# EAGLE design esplash (EAGLE 9.6.2)
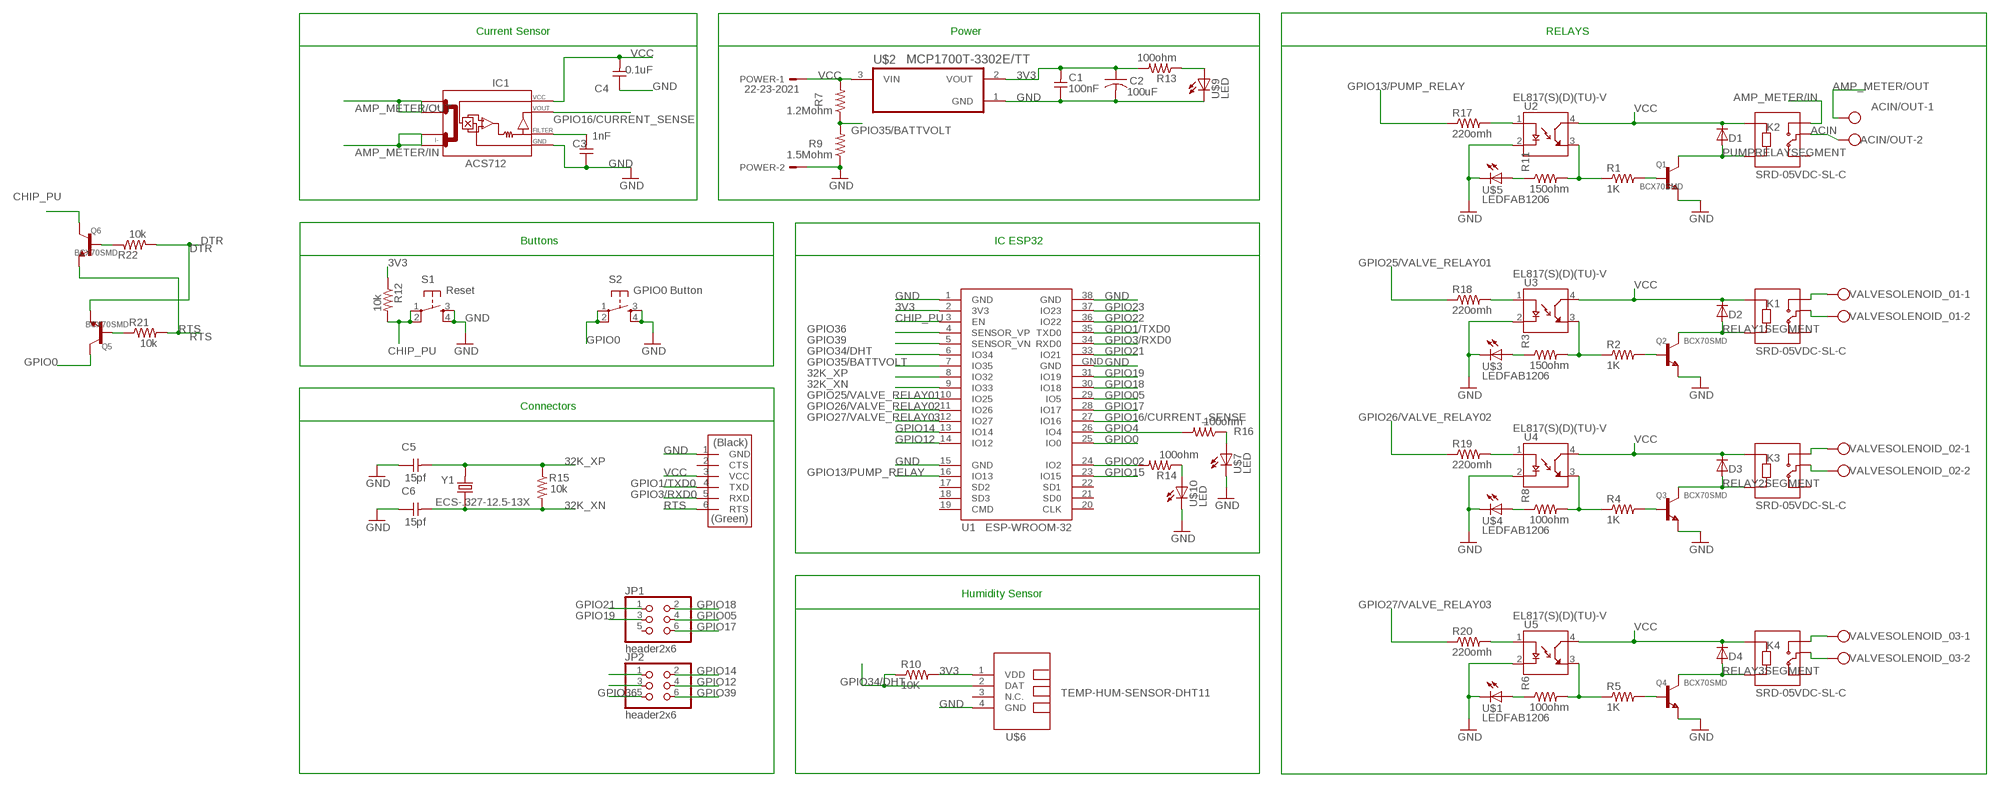
[diagram p0: schematic, sheet 1]

## Parts
ACIN/OUT  W237-102  [W237-102]
C1  100nF  CAP-UNPOLARIZEDFAB  [C1206FAB]
C2  100uF  CAP-US1206FAB  [C1206FAB]
C3  1nF  CAP-UNPOLARIZEDFAB  [C1206FAB]
C4  0.1uF  CAP-UNPOLARIZEDFAB  [C1206FAB]
C5  15pf  CAP-UNPOLARIZEDFAB  [C1206FAB]
C6  15pf  CAP-UNPOLARIZEDFAB  [C1206FAB]
D1  DIODESOD123  [SOD123]
D2  DIODESOD123  [SOD123]
D3  DIODESOD123  [SOD123]
D4  DIODESOD123  [SOD123]
IC1  ACS712  [SO08]
JP1  header2x6  PINHD-2X3  [2X03]
JP2  header2x6  PINHD-2X3  [2X03]
K1  SRD-05VDC-SL-C  [RELAY_SRD-05VDC-SL-C]
K2  SRD-05VDC-SL-C  [RELAY_SRD-05VDC-SL-C]
K3  SRD-05VDC-SL-C  [RELAY_SRD-05VDC-SL-C]
K4  SRD-05VDC-SL-C  [RELAY_SRD-05VDC-SL-C]
POWER  22-23-2021  [22-23-2021]
Q1  BCX70SMD  [SOT23]
Q2  BCX70SMD  [SOT23]
Q3  BCX70SMD  [SOT23]
Q4  BCX70SMD  [SOT23]
Q5  BCX70SMD  [SOT23]
Q6  BCX70SMD  [SOT23]
R1  1K  RES-US1206FAB  [R1206FAB]
R2  1K  RES-US1206FAB  [R1206FAB]
R3  150ohm  RES-US1206FAB  [R1206FAB]
R4  1K  RES-US1206FAB  [R1206FAB]
R5  1K  RES-US1206FAB  [R1206FAB]
R6  100ohm  RES-US1206FAB  [R1206FAB]
R7  1.2Mohm  RES-US1206FAB  [R1206FAB]
R8  100ohm  RES-US1206FAB  [R1206FAB]
R9  1.5Mohm  RES-US1206FAB  [R1206FAB]
R10  10K  RES-US1206FAB  [R1206FAB]
R11  150ohm  RES-US1206FAB  [R1206FAB]
R12  10k  RES-US1206  [R1206]
R13  100ohm  RES-US1206  [R1206]
R14  100ohm  RES-US1206  [R1206]
R15  10k  RES-US1206  [R1206]
R16  100ohm  RES-US1206  [R1206]
R17  220omh  RES-US1206FAB  [R1206FAB]
R18  220omh  RES-US1206FAB  [R1206FAB]
R19  220omh  RES-US1206FAB  [R1206FAB]
R20  220omh  RES-US1206FAB  [R1206FAB]
R21  10k  RES-US1206  [R1206]
R22  10k  RES-US1206  [R1206]
RTS  FTDI-SMD-HEADER  [1X06SMD]
S1  Reset  6MM_SWITCH6MM_SWITCH  [6MM_SWITCH]
S2  GPIO0 Button  6MM_SWITCH6MM_SWITCH  [6MM_SWITCH]
U1  ESP-WROOM-32  [ESP-WROOM-32]
U2  EL817(S)(D)(TU)-V  [SOIC254P1030X460-4N]
U3  EL817(S)(D)(TU)-V  [SOIC254P1030X460-4N]
U4  EL817(S)(D)(TU)-V  [SOIC254P1030X460-4N]
U5  EL817(S)(D)(TU)-V  [SOIC254P1030X460-4N]
U$1  LEDFAB1206  [LED1206FAB]
U$2  MCP1700T-3302E/TT  [SOT95P237X112-3N]
U$3  LEDFAB1206  [LED1206FAB]
U$4  LEDFAB1206  [LED1206FAB]
U$5  LEDFAB1206  [LED1206FAB]
U$6  TEMP-HUM-SENSOR-DHT11  [TEMP-HUM-SENSOR-DHT11]
U$7  LED  [LED1206]
U$9  LED  [LED1206]
U$10  LED  [LED1206]
VALVESOLENOID_01  W237-102  [W237-102]
VALVESOLENOID_02  W237-102  [W237-102]
VALVESOLENOID_03  W237-102  [W237-102]
Y1  ECS-.327-12.5-13X  [XTAL_ECS-.327-12.5-13X]

## Nets
3V3: C1.2 C2.1 R10.2 R12.1 R13.2 U1.2(3V3) U$2.2(VOUT) U$6.1(VDD)
32K_XN: C6.2 R15.2 U1.9(IO33) Y1.1
32K_XP: C5.2 R15.1 U1.8(IO32) Y1.2
ACIN: ACIN/OUT.2 K2.COM
AMP_METER/IN: IC1.3(I-_0) IC1.4(I-_1) K2.NO
AMP_METER/OUT: ACIN/OUT.1 IC1.1(I+_0) IC1.2(I+_1)
CHIP_PU: Q6.3(C) R12.2 S1.1(P) S1.2(P1) U1.3(EN)
DELETE: C3.2 IC1.6(FILTER)
DTR: Q5.2(E) R22.2
GND: C1.1 C2.2 C3.1 C4.1 C5.1 C6.1 IC1.5(GND) POWER.2 Q1.2(E) Q2.2(E) Q3.2(E) Q4.2(E) R9.1 RTS.1(GND) S1.3(S) S1.4(S1) S2.3(S) S2.4(S1) U1.1(GND) U1.15(GND) U1.38(GND) U1.GND U2.2(C) U3.2(C) U4.2(C) U5.2(C) U$1.2(C) U$2.1(GND) U$3.2(C) U$4.2(C) U$5.2(C) U$6.4(GND) U$7.2(C) U$9.2(C) U$10.2(C)
GPIO0: Q5.3(C) S2.1(P) S2.2(P1) U1.25(IO0)
GPIO1/TXD0: RTS.4(TXD) U1.35(TXD0)
GPIO02: R14.2 U1.24(IO2)
GPIO3/RXD0: RTS.5(RXD) U1.34(RXD0)
GPIO4: R16.2 U1.26(IO4)
GPIO05: JP1.4 U1.29(IO5)
GPIO12: JP2.4 U1.14(IO12)
GPIO13/PUMP_RELAY: R17.1 U1.16(IO13)
GPIO14: JP2.2 U1.13(IO14)
GPIO15: U1.23(IO15)
GPIO16/CURRENT_SENSE: IC1.7(VOUT) U1.27(IO16)
GPIO17: JP1.6 U1.28(IO17)
GPIO18: JP1.2 U1.30(IO18)
GPIO19: JP1.3 U1.31(IO19)
GPIO21: JP1.1 U1.33(IO21)
GPIO22: U1.36(IO22)
GPIO23: U1.37(IO23)
GPIO25/VALVE_RELAY01: R18.1 U1.10(IO25)
GPIO26/VALVE_RELAY02: R19.1 U1.11(IO26)
GPIO27/VALVE_RELAY03: R20.1 U1.12(IO27)
GPIO34/DHT: R10.1 U1.6(IO34) U$6.2(DAT)
GPIO35/BATTVOLT: R7.1 R9.2 U1.7(IO35)
GPIO36: JP2.5 U1.4(SENSOR_VP)
GPIO39: JP2.6 U1.5(SENSOR_VN)
N$2: R1.1 R11.2 U2.3(ET)
N$5: K1.COM VALVESOLENOID_01.2
N$7: Q2.1(B) R2.2
N$8: R11.1 U$5.1(A)
N$10: R14.1 U$10.1(A)
N$12: K1.NO VALVESOLENOID_01.1
N$13: R3.1 U$3.1(A)
N$14: R2.1 R3.2 U3.3(ET)
N$15: K3.COM VALVESOLENOID_02.2
N$16: Q3.1(B) R4.2
N$17: R8.1 U$4.1(A)
N$18: R4.1 R8.2 U4.3(ET)
N$19: K3.NO VALVESOLENOID_02.1
N$20: K4.COM VALVESOLENOID_03.2
N$21: Q4.1(B) R5.2
N$22: R6.1 U$1.1(A)
N$23: R5.1 R6.2 U5.3(ET)
N$24: K4.NO VALVESOLENOID_03.1
N$25: R13.1 U$9.1(A)
N$26: Q5.1(B) R21.1
N$27: JP2.1
N$28: JP2.3
N$29: R16.1 U$7.1(A)
N$30: R17.2 U2.1(A)
N$31: R18.2 U3.1(A)
N$32: R19.2 U4.1(A)
N$33: R20.2 U5.1(A)
N$34: Q6.1(B) R22.1
N$43: Q1.1(B) R1.2
PUMPRELAYSEGMENT: D1.ANODE(A) K2.A2 Q1.3(C)
RELAY1SEGMENT: D2.ANODE(A) K1.A2 Q2.3(C)
RELAY2SEGMENT: D3.ANODE(A) K3.A2 Q3.3(C)
RELAY3SEGMENT: D4.ANODE(A) K4.A2 Q4.3(C)
RTS: Q6.2(E) R21.2 RTS.6(RTS)
VCC: C4.2 D1.CATHODE(C) D2.CATHODE(C) D3.CATHODE(C) D4.CATHODE(C) IC1.8(VCC) K1.A1 K2.A1 K3.A1 K4.A1 POWER.1 R7.2 RTS.3(VCC) U2.4(CT) U3.4(CT) U4.4(CT) U5.4(CT) U$2.3(VIN)
Unconnected: JP1.5 K1.NC K2.NC K3.NC K4.NC RTS.2(CTS) U1.17(SD2) U1.18(SD3) U1.19(CMD) U1.20(CLK) U1.21(SD0) U1.22(SD1) U$6.3(N.C.)

## Notes on the sheet
- Current Sensor | Power | RELAYS
- Buttons | IC ESP32
- Connectors
- Humidity Sensor

## Library data of the parts
ACIN/OUT VALVESOLENOID_01-VALVESOLENOID_03 = con-wago-500:W237-102: WAGO SCREW CLAMP; MPN: 237-102; OC_FARNELL: unknown; OC_NEWARK: 70K9898
C1 C3-C6 = fab:CAP-UNPOLARIZED
C2 = fab:CAP-US
D1-D4 = fab:DIODE: DIODE high speed (Philips)
IC1 = ACS712:ACS712
JP1 JP2 = pinhead:PINHD-2X3: PIN HEADER
K1-K4 = SRD-05VDC-SL-C:SRD-05VDC-SL-C: 5V Trigger Relay Module For Arduino And Raspberry Pi 5V Trigger Relay Module For Arduino And Raspberry Pi; AVAILABILITY: Unavailable; DESCRIPTION: 5V Trigger Relay Module For Arduino And Raspberry Pi 5V Trigger Relay Module For Arduino And Raspberry Pi; MF: Songle Relay; MP: SRD-05VDC-SL-C; PACKAGE: None; PRICE: None
POWER = con-molex:22-23-2021: .100" (2.54mm) Center Header - 2 Pin; MF: MOLEX; MPN: 22-23-2021; OC_FARNELL: 1462926; OC_NEWARK: 25C3832
Q1-Q6 = transistor:BCX70SMD: NPN TRANSISTOR
R1-R22 = fab:RES-US: Resistor (US Symbol) Variants with postfix FAB are widened to allow the routing of internal traces
RTS = fab:FTDI-SMD-HEADER
S1 S2 = fab:6MM_SWITCH: OMRON SWITCH
U1 = esp32:ESP-WROOM-32: Espressif Systems ESP-WROOM-32
U2-U5 = EL817_S__D__TU_-V:EL817(S)(D)(TU)-V: Optocoupler DC-IN 1-CH Transistor DC-OUT 4-Pin PDIP Tube; AVAILABILITY: Unavailable; DESCRIPTION: Optoisolator Transistor Output 5000Vrms 1 Channel 4-SMD; MF: Everlight Electronics; MP: EL817(S)(D)(TU)-V; PACKAGE: SMD-4 Everlight; PRICE: None
U$1 U$3-U$5 U$7 U$9 U$10 = fab:LED: LED
U$2 = MCP1700T-3302E_TT:MCP1700T-3302E/TT; ARROW_AMERICAS-PURCHASE-URL: https://snapeda.com/shop?store=Arrow+Americas&id=4791194; AVAILABILITY: Unavailable; DESCRIPTION: IC REG LINEAR 3.3V 250MA SOT23-3; DIGIKEY-PURCHASE-URL: https://snapeda.com/shop?store=DigiKey&id=4791194; MF: Microchip Technology; MOUSER-PURCHASE-URL: https://snapeda.com/shop?store=Mouser&id=4791194; MP: MCP1700T-3302E/TT; PACKAGE: None; PRICE: None
U$6 = diy-modules:TEMP-HUM-SENSOR-DHT11: DHT11 - digital humidity & temperature sensor DHT11 datasheet available here: https://akizukidenshi.com/download/ds/aosong/DHT11.pdf Click here to find device on ebay.com <http://www.ebay.com/sch/dht11+digital+sensor>
Y1 = ECS-.327-12.5-13X:ECS-.327-12.5-13X: Crystal Cylindrical Can, Radial; AVAILABILITY: Unavailable; DESCRIPTION: 32.768kHz ±20ppm Crystal 12.5pF 35 kOhms Cylindrical Can, Radial; MF: ECS Inc.; MP: ECS-.327-12.5-13X; PACKAGE: Cylindrical Can Radial ECS International; PRICE: None

## Board
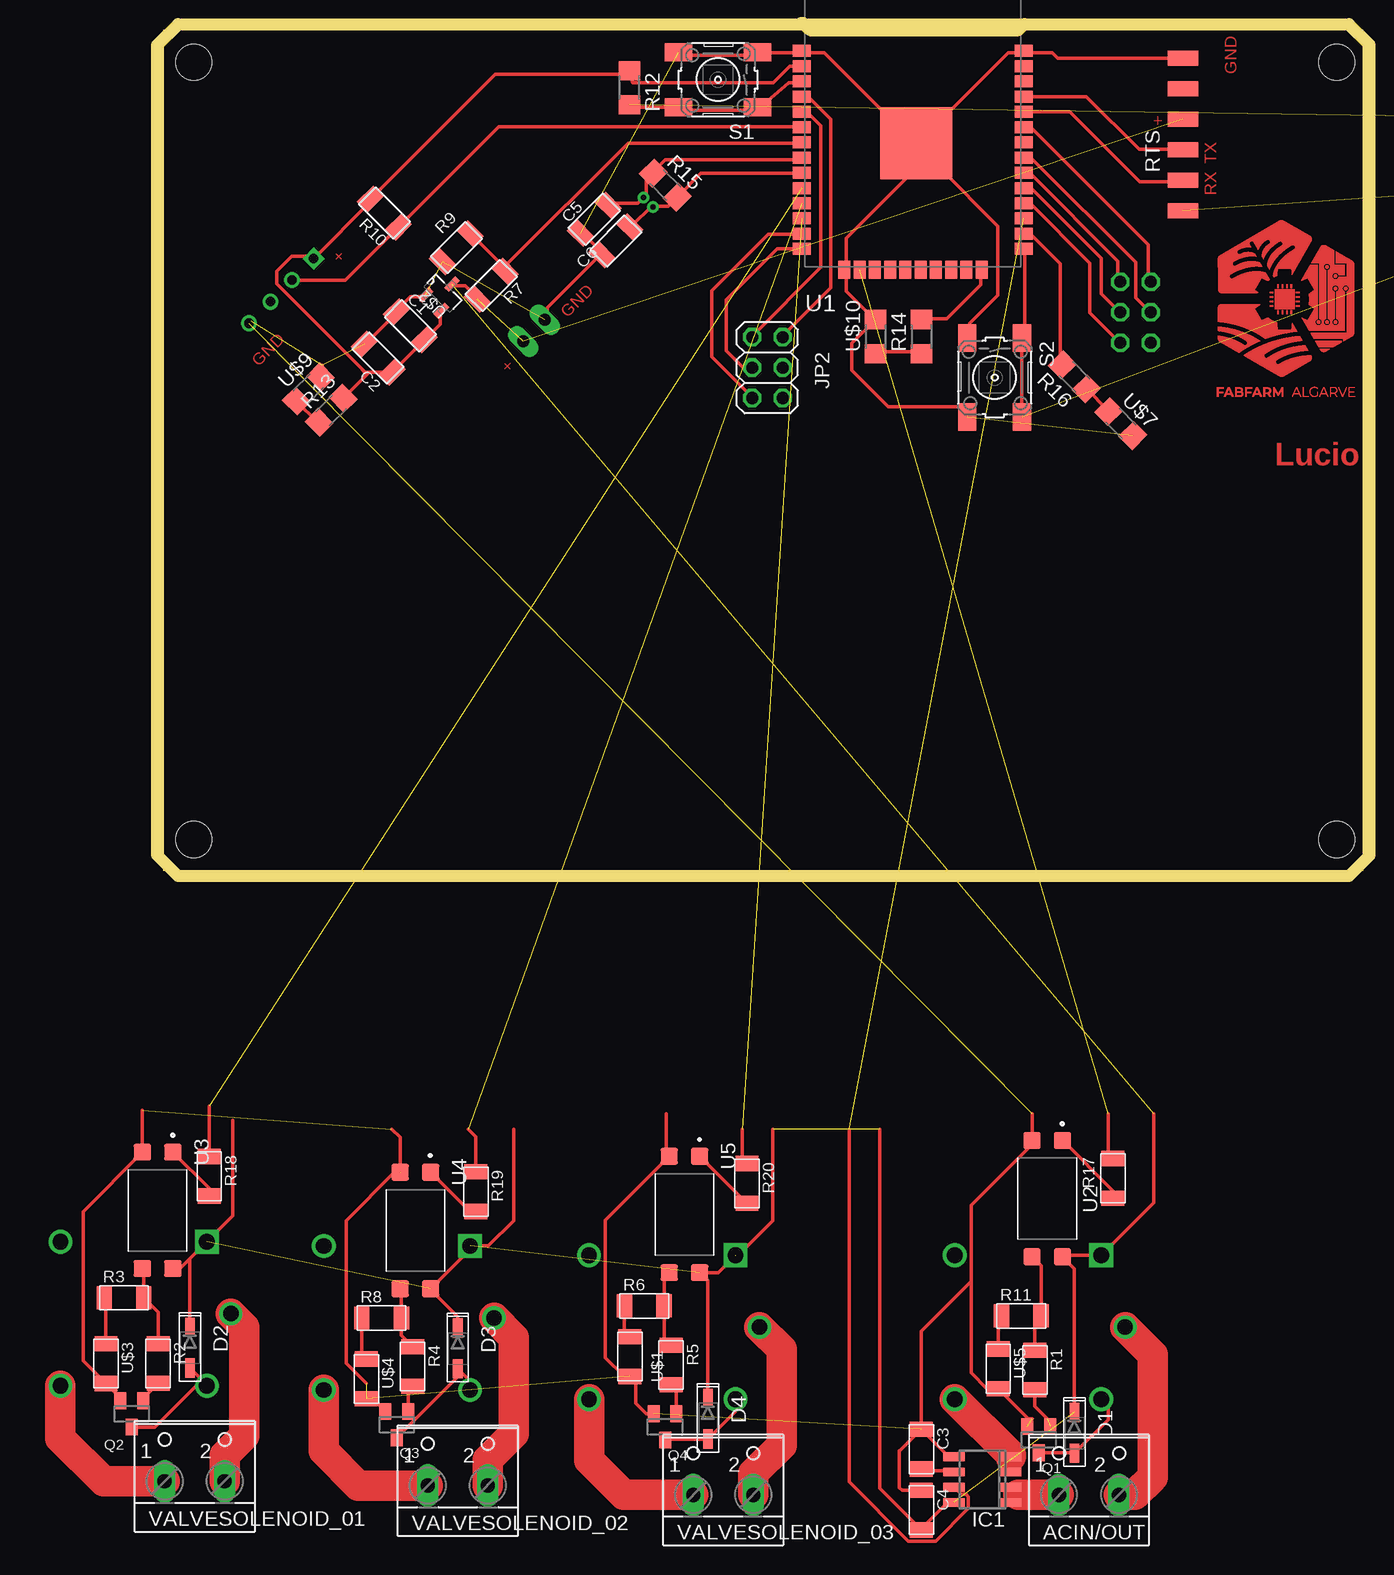
[diagram p1: board, top side]
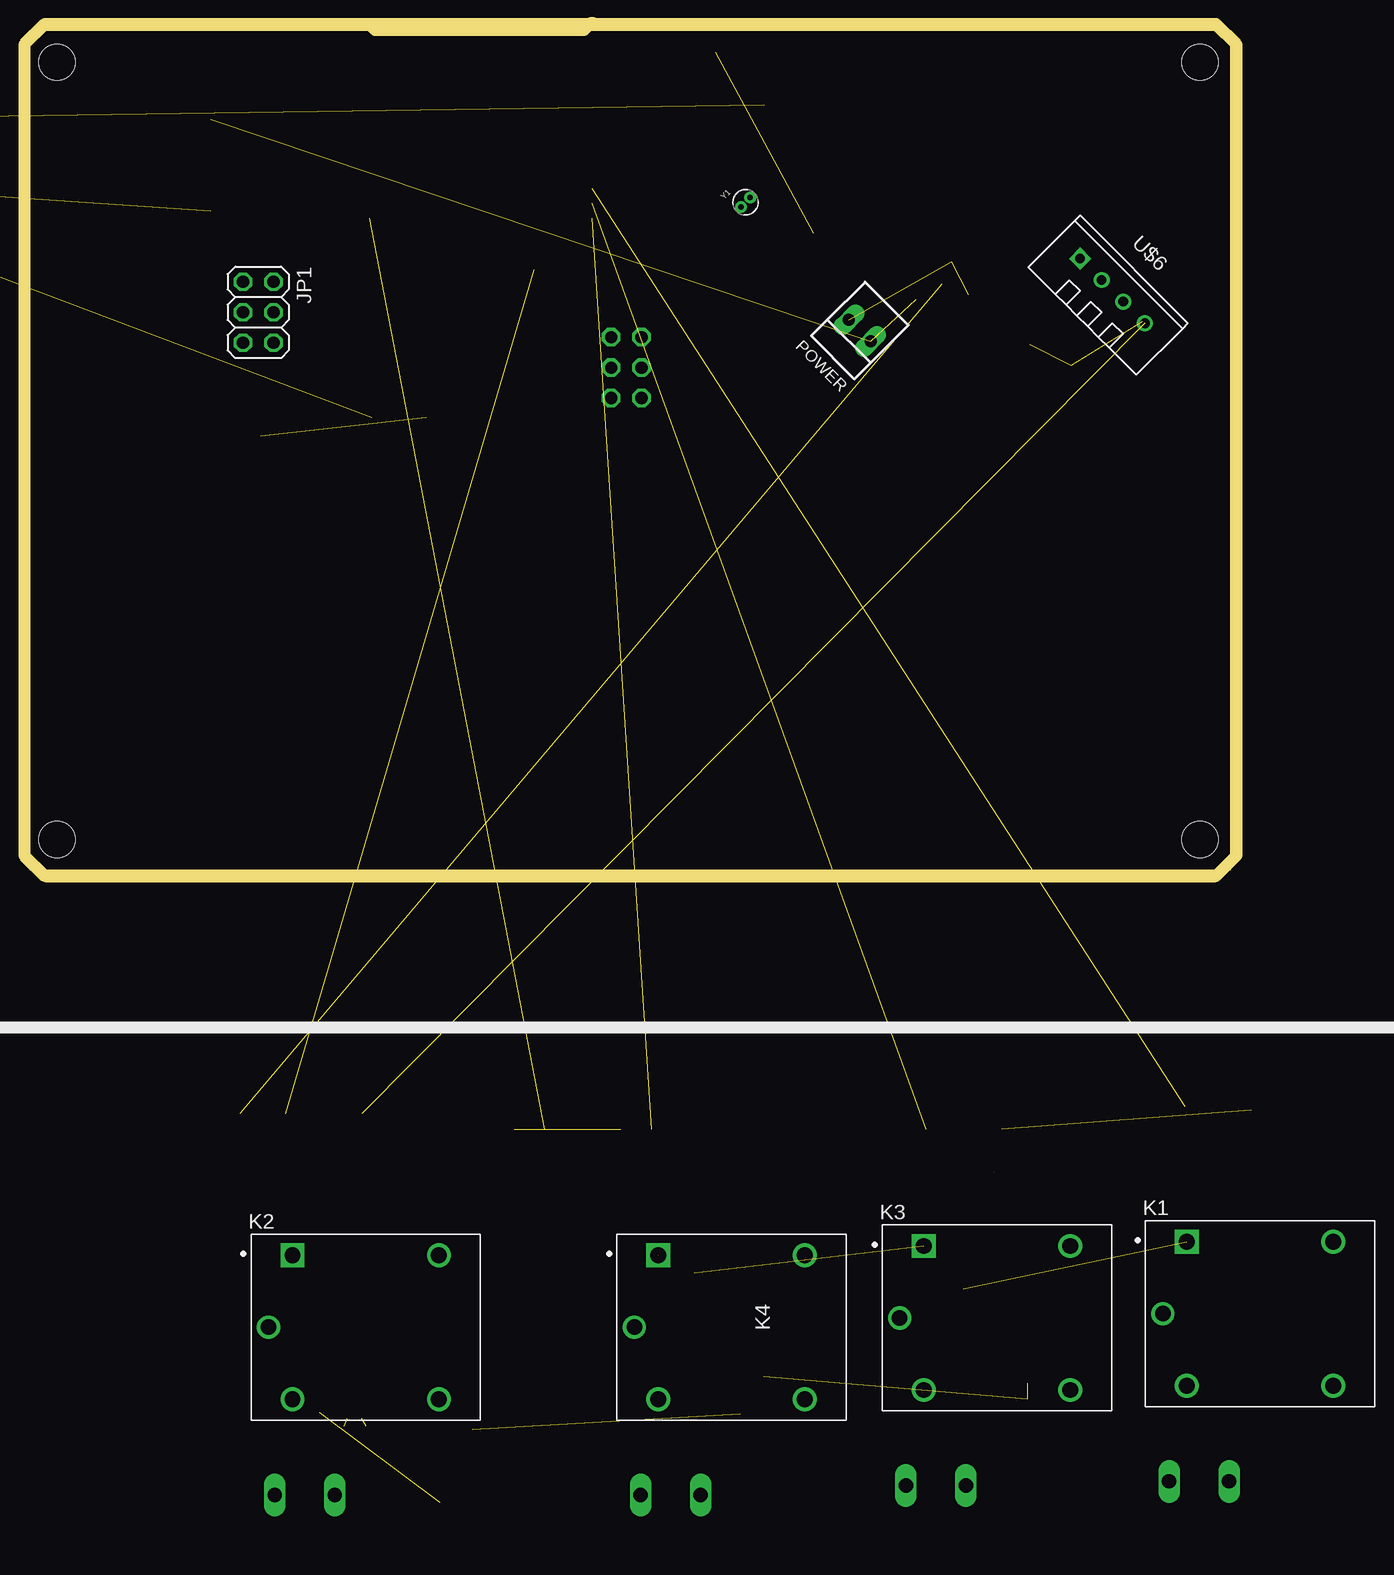
[diagram p2: board, bottom side, seen from below]

Size 100 x 70 mm. Coordinates in mm from the lower left corner, seen from the top.
Outline: 0,0 100,0 100,70 0,70 0,0
Copper layers (1*16): Top 0.035mm / dielectric 1.5mm / Bottom 0.035mm
Design rules "default *": minimum track width 12mil, minimum drill 0.35mm, track to track 6mil, track to pad 6mil, pad to pad 6mil, via to via 6mil, smd to smd 6mil, copper to edge 40mil, drill to drill 6mil, minimum pad ring 10mil, minimum via ring 8mil, stop-mask expansion 4mil, vias tented up to drill 0mil, thermal gap 10mil
Holes 3 mm at 2.54,67.31 97.79,67.31 97.79,2.54 2.54,2.54
Milling: 12 lines

### Footprints (pad centres in the part's own frame; a part is rotated, then mirrored left to right if it is on the bottom)
W237-102 = drill 1.194 long: 1 -2.5,-1.27; 2 2.5,-1.27
C1206FAB = smd 1.27 x 1.905: 1 -1.651,0; 2 1.651,0
SOD123 = smd 1.6 x 0.8: ANODE 1.7,0; CATHODE -1.7,0
SO08 = smd 0.72 x 1.78: 1 -1.905,-2.35; 2 -0.635,-2.35; 3 0.635,-2.35; 4 1.905,-2.35; 5 1.905,2.35; 6 0.635,2.35; 7 -0.635,2.35; 8 -1.905,2.35
2X03 = drill 1.016 octagon: 1 -2.54,-1.27; 2 -2.54,1.27; 3 0,-1.27; 4 0,1.27; 5 2.54,-1.27; 6 2.54,1.27
RELAY_SRD-05VDC-SL-C = drill 1.32 square: A1 -6.1,6 | drill 1.32: A2 -6.1,-6; NC 6.1,6; NO 6.1,-6 | drill 1.29: COM -8.1,0
22-23-2021 = drill 1 long: 1 -1.27,0; 2 1.27,0
SOT23 = smd 1 x 1.4: 1 -0.95,-1.1; 2 0.95,-1.1; 3 0,1.1
R1206FAB = smd 1.27 x 1.905: 1 -1.651,0; 2 1.651,0
R1206 = smd 1.6 x 1.803: 1 -1.422,0; 2 1.422,0
1X06SMD = smd 2.54 x 1.27: 1 0,6.35; 2 0,3.81; 3 0,1.27; 4 0,-1.27; 5 0,-3.81; 6 0,-6.35
6MM_SWITCH = smd 2.286 x 1.524: 1 -3.302,2.286; 2 3.302,2.286; 3 -3.302,-2.286; 4 3.302,-2.286
ESP-WROOM-32 = smd 1.5 x 1: 1 -9.25,7; 2 -9.25,5.73; 3 -9.25,4.46; 4 -9.25,3.19; 5 -9.25,1.92; 6 -9.25,0.65; 7 -9.25,-0.62; 8 -9.25,-1.89; 9 -9.25,-3.16; 10 -9.25,-4.43; 11 -9.25,-5.7; 12 -9.25,-6.97; 13 -9.25,-8.24; 14 -9.25,-9.51; 25 9.25,-9.51; 26 9.25,-8.24; 27 9.25,-6.97; 28 9.25,-5.7; 29 9.25,-4.43; 30 9.25,-3.16; 31 9.25,-1.89; 32 9.25,-0.62; 33 9.25,0.65; 34 9.25,1.92; 35 9.25,3.19; 36 9.25,4.46; 37 9.25,5.73; 38 9.25,7 | smd 1 x 1.5: 15 -5.7,-11.25; 16 -4.43,-11.25; 17 -3.16,-11.25; 18 -1.89,-11.25; 19 -0.62,-11.25; 20 0.65,-11.25; 21 1.92,-11.25; 22 3.19,-11.25; 23 4.46,-11.25; 24 5.73,-11.25 | smd 6 x 6: GND 0.3,-0.7
SOIC254P1030X460-4N = smd 1.41 x 1.47: 1 -4.85,1.27; 2 -4.85,-1.27; 3 4.85,-1.27; 4 4.85,1.27
LED1206FAB = smd 1.27 x 1.905: 1 -1.651,0; 2 1.651,0
SOT95P237X112-3N = smd 1.321 x 0.559: 1 -1.092,0.94; 2 -1.092,-0.94 | smd 1.321 x 0.508: 3 1.092,0
TEMP-HUM-SENSOR-DHT11 = drill 0.8 square: 1 -3.81,0 | drill 0.8: 2 -1.27,0; 3 1.27,0; 4 3.81,0
LED1206 = smd 1.6 x 1.803: 1 -1.422,0; 2 1.422,0
XTAL_ECS-.327-12.5-13X = drill 0.46 pad 0.86: 1 -0.55,0; 2 0.55,0

### Placement (x,y rotation side)
ACIN/OUT  77.14,-50.8 0 top  (outside the outline)
C1  20.59,45.35 315 top
C2  17.9,42.66 135 top
C3  63.17,-48.26 270 top  (outside the outline)
C4  63.17,-53.34 270 top  (outside the outline)
C5  35.92,54.22 45 top
C6  37.71,52.43 45 top
D1  75.93,-46.91 270 top  (outside the outline)
D2  2.22,-39.8 270 top  (outside the outline)
D3  24.54,-39.87 270 top  (outside the outline)
D4  45.39,-45.72 270 top  (outside the outline)
IC1  68.25,-50.8 90 top  (outside the outline)
JP1  81.02,46.47 270 bottom
JP2  50.34,41.87 90 top
K1  -2.47,-36.97 0 bottom  (outside the outline)
K2  72.06,-38.1 0 bottom  (outside the outline)
K3  19.46,-37.33 0 bottom  (outside the outline)
K4  41.58,-38.1 0 bottom  (outside the outline)
POWER  30.89,44.95 135 bottom
Q1  72.95,-47.47 180 top  (outside the outline)
Q2  -2.63,-45.32 180 top  (outside the outline)
Q3  19.46,-46.22 180 top  (outside the outline)
Q4  41.81,-46.41 180 top  (outside the outline)
Q5  156.21,68.58 0 top  (outside the outline)
Q6  156.21,60.96 0 top  (outside the outline)
R1  72.63,-41.67 270 top  (outside the outline)
R2  -0.43,-41.13 270 top  (outside the outline)
R3  -3.27,-35.65 0 top  (outside the outline)
R4  20.78,-41.37 270 top  (outside the outline)
R5  42.32,-41.25 270 top  (outside the outline)
R6  40.08,-36.32 0 top  (outside the outline)
R7  27.33,48.72 225 top
R8  18.19,-37.33 0 top  (outside the outline)
R9  24.42,51.87 45 top
R10  18.43,54.75 135 top
R11  71.49,-37.16 0 top  (outside the outline)
R12  38.84,65.19 270 top
R13  13.98,38.31 45 top
R14  63.17,44.45 90 top
R15  41.83,57.07 315 top
R16  75.91,41.09 135 top
R17  79.12,-25.69 270 top  (outside the outline)
R18  3.83,-25.52 270 top  (outside the outline)
R19  26.04,-26.8 270 top  (outside the outline)
R20  48.64,-26.12 270 top  (outside the outline)
R21  156.21,53.34 0 top  (outside the outline)
R22  161.29,53.34 0 top  (outside the outline)
RTS  84.96,61.3 0 top
S1  46.22,65.85 180 top
S2  69.28,41.04 270 top
U1  62.46,61.26 0 top
U2  73.66,-27.39 270 top  (outside the outline)
U3  -0.47,-28.36 270 top  (outside the outline)
U4  21,-30.04 270 top  (outside the outline)
U5  43.43,-28.7 270 top  (outside the outline)
U$1  38.88,-40.55 270 top  (outside the outline)
U$2  23.28,48.05 45 top
U$3  -4.78,-41.13 270 top  (outside the outline)
U$4  16.92,-42.41 270 top  (outside the outline)
U$5  69.58,-41.57 270 top  (outside the outline)
U$6  9.83,48.26 315 bottom
U$7  79.79,37.2 315 top
U$9  12.1,40.08 45 top
U$10  59.36,44.45 90 top
VALVESOLENOID_01  2.61,-49.67 0 top  (outside the outline)
VALVESOLENOID_02  24.54,-50.03 0 top  (outside the outline)
VALVESOLENOID_03  46.66,-50.8 0 top  (outside the outline)
Y1  40.41,55.65 45 bottom

### Tracks (layer width: path | path; a pad name or v marks a point on that pad's centre or on a via)
3V3
  Top 0.305: U1.2 53.04,66.98 52.21,66.98 50.85,65.62 39.12,65.62 38.92,66.32 | 38.92,66.32 R12.1 38.63,66.52 | U$2.2 23.09,46.41 23.09,45.49 21.95,44.35 C1.2 21.72,44.12 19.2,41.6 C2.1 16.92,41.49 16.85,41.42 16.76,41.51 | R13.2 16.98,41.31 16.96,41.33 16.77,41.52 | U$6.1 12.31,51.16 10.71,51.16 9.44,49.89 9.44,48.86 16.77,41.52 | 16.76,41.51 16.58,41.69 | 12.57,50.98 U$6.1 | 16.75,41.5 16.76,41.51 | 16.76,41.51 16.77,41.52 | U$6.1 17.26,55.69 R10.2 27.66,66.32 38.92,66.32
32K_XN
  Top 0.305: C6.2 39.09,53.72 40.69,55.32 Y1.1 40.92,55.32 42.06,55.32 42.75,56.01 R15.2 42.98,56.24 44.81,58.06 53.04,58.06 U1.9
32K_XP
  Top 0.305: C5.2 37.26,55.55 39.55,55.55 40.01,56.01 Y1.2 40.23,56.24 40.23,57.61 40.69,58.06 R15.1 40.92,58.29 41.83,59.21 53.04,59.21 U1.8
ACIN
  Top 2.54: ACIN/OUT.2 80.96,-52.07 82.44,-50.6 82.44,-40.38 K2.COM
AMP_METER/IN
  Top 0.305: IC1.3 70.74,-50.06 IC1.4
  Top 2.54: IC1.4 70.6,-48.74 K2.NO
AMP_METER/OUT
  Top 0.305: IC1.1 70.74,-52.58 71.23,-52.07 70.74,-51.44 IC1.2
  Top 2.54: 71.23,-52.07 ACIN/OUT.1
CHIP_PU  (1 unrouted)
  Top 0.305: R12.2 38.86,63.55 42.75,63.55 42.98,63.32 42.98,63.51 S1.2 43.09,63.32 49.38,63.32 | 49.61,63.32 49.38,63.32 | 49.18,63.16 S1.1 | 49.38,63.32 S1.1 | U1.3 53.04,65.61 52.12,65.61 49.76,63.57 49.63,63.62 S1.1
DELETE
  Top 0.305: IC1.6 65.71,-50.06 63.2,-50.06 C3.2
DTR  (1 unrouted)
GND  (13 unrouted)
  Top 0.305: U$2.1 21.72,47.78 20.57,47.78 19.43,46.63 C1.1 19.43,46.41 16.92,43.89 C2.2 | C5.1 34.98,53.03 36.58,51.44 C6.1 36.35,51.21 32,46.86 32,45.95 POWER.2 | S1.3 50.05,68.14 50.06,68.12 53.04,68.12 U1.1 53.26,68.12 55.09,68.12 62.64,60.58 U1.GND | 49.61,67.89 49.15,67.89 | 49.15,67.89 43.09,67.89 S1.4 | 49.18,67.73 S1.3 | U1.GND 62.87,60.58 70.41,68.12 71.55,68.12 U1.38 71.78,68.12 74.09,68.12 74.55,67.67 84.81,67.67 RTS.1 | 63.74,59.47 62.87,60.35 U1.GND | 63.74,59.47 64.69,58.52 | 64.69,58.52 69.55,53.67 69.55,47.91 67.21,45.57 67.21,44.35 S2.3 | 63.74,59.47 56.92,52.65 56.92,50.06 U1.15 56.92,49.84 56.92,48.23 59.21,45.95 U$10.2 57.37,43.88 57.37,41.65 60.43,38.59 66.94,38.59 S2.4 | 64.69,58.52 U1.GND | C3.1 61.39,-48.39 61.35,-48.39 61.35,-51.46 61.58,-51.69 C4.1 | POWER.2 31.78,45.72 31.78,45.49 POWER.2 | 13.26,42.06 13.1,41.9 U$9.2 13.16,41.03 | 7.32,45.72 U$6.4 7.14,45.55 | IC1.5 65.71,-48.7 65.25,-48.69 63.2,-46.63 C3.1 | 49.15,67.89 S1.3 | Q2.2 -3.58,-43.99 U$3.2 -6.69,-40.88 -6.69,-28.46 U3.2 -1.74,-20.03 | Q3.2 17.45,-44.06 U$4.2 | 16.92,-42.79 15.24,-41.11 15.24,-29.21 19.26,-25.19 U4.2 19.73,-22.27 19.05,-21.59 | 41.91,-20.32 41.91,-23.61 U5.2 36.83,-29.18 36.83,-40.64 38.39,-42.2 U$1.2 39.37,-42.69 39.37,-44.45 40.23,-45.31 Q4.2 | 72.39,-45.72 72.08,-45.72 U$5.2 68.62,-43.22 67.31,-41.91 67.31,-34.29 | 72.39,-20.32 U2.2 72.39,-22.86 67.31,-27.94 67.31,-34.29 | C3.1 63.17,-38.43 67.31,-34.29
GPIO0  (1 unrouted)
  Top 0.305: U1.25 71.78,51.66 71.78,44.35 S2.1 71.55,44.12 71.55,37.95 S2.2
GPIO1/TXD0
  Top 0.305: U1.35 76.91,64.45 81.32,60.04 84.94,60.04 RTS.4
GPIO02
  Top 0.305: U1.24 68.12,49.84 68.12,48.78 65.29,45.95 63.32,45.95 R14.2
GPIO3/RXD0
  Top 0.305: U1.34 75.55,63.18 81.37,57.37 84.84,57.37 RTS.5
GPIO4
  Top 0.305: U1.26 71.78,52.81 72.47,52.81 74.75,50.52 74.75,42.29 R16.2
GPIO05
  Top 0.305: U1.29 71.78,56.69 72.47,56.69 78.17,50.99 78.17,48.02 79.55,46.63 JP1.4
GPIO12
  Top 0.305: U1.14 51.15,51.75 46.9,47.51 46.9,43.28 48.32,41.87 JP2.4
GPIO13/PUMP_RELAY  (1 unrouted)
  Top 0.305: R17.1 78.74,-23.66 78.74,-20.32
GPIO14
  Top 0.305: U1.13 53.17,52.97 50.42,52.97 45.71,48.27 45.71,42.76 48.92,39.55 JP2.2
GPIO16/CURRENT_SENSE  (1 unrouted)
  Top 0.305: 57.15,-21.59 57.15,-50.99 62.09,-55.93 64.36,-55.93 67.09,-53.19 67.09,-52.22 66.92,-52.04 66.51,-52.04 IC1.7
GPIO17
  Top 0.305: U1.28 71.78,55.55 72.24,55.55 77.22,50.57 77.22,46.46 79.55,44.12 JP1.6
GPIO18
  Top 0.305: U1.30 71.78,58.06 72.24,58.06 79.55,50.75 79.55,49.15 JP1.2
GPIO19
  Top 0.305: U1.31 71.78,59.21 72.47,59.21 81.03,50.64 81.03,47.67 82.07,46.63 JP1.3
GPIO21
  Top 0.305: U1.33 71.78,61.72 72.47,61.72 82.07,52.12 82.07,49.15 JP1.1
GPIO25/VALVE_RELAY01  (1 unrouted)
  Top 0.305: U1.10 | R18.1 3.83,-19.69
GPIO26/VALVE_RELAY02  (1 unrouted)
  Top 0.305: R19.1 26.04,-22.23 25.4,-21.59
GPIO27/VALVE_RELAY03  (1 unrouted)
  Top 0.305: R20.1 48.26,-24.09 48.26,-21.59
GPIO34/DHT
  Top 0.305: U1.6 53.04,61.95 27.96,61.95 R10.1 15.17,49.16 U$6.2
GPIO35/BATTVOLT
  Top 0.305: U1.7 53.04,60.58 38.73,60.58 28.5,50.35 R7.1 28.38,50.26 25.6,53.03 R9.2
GPIO36
  Top 0.305: U1.4 53.26,64.24 53.95,64.24 55.6,62.58 55.6,48.52 51.66,44.58 JP2.5
GPIO39
  Top 0.305: U1.5 53.26,63.09 53.72,63.09 54.8,62.02 54.8,50.23 49.15,44.58 JP2.6
N$2
  Top 0.305: R1.1 72.63,-37.67 R11.2 73.14,-32.99 U2.3
N$5
  Top 2.54: VALVESOLENOID_01.2 5.11,-48.77 6.75,-47.13 6.75,-38.09 K1.COM
N$7
  Top 0.305: -1.07,-42.84 R2.2 -1.68,-44.02 Q2.1
N$8
  Top 0.305: U$5.1 69.57,-37.42 R11.1
N$10
  Top 0.305: U$10.1 59.44,43.2 63.09,43.2 R14.1
N$12
  Top 2.54: K1.NO -8.57,-47.34 -4.97,-50.94 VALVESOLENOID_01.1
N$13
  Top 0.305: R3.1 -4.78,-35.79 U$3.1
N$14
  Top 0.305: -0.21,-39.37 R2.1 -0.43,-36.84 R3.2 -1.62,-33.33 U3.3
N$15
  Top 2.54: VALVESOLENOID_02.2 27.04,-49.16 29.21,-46.99 29.21,-38.98 K3.COM
N$16
  Top 0.305: Q3.1 20.41,-43.39 R4.2
N$17
  Top 0.305: U$4.1 16.54,-40.38 R8.1
N$18
  Top 0.305: R4.1 19.84,-38.79 R8.2 19.84,-35 U4.3
N$19
  Top 2.54: K3.NO 13.36,-48.41 16.25,-51.3 VALVESOLENOID_02.1
N$20
  Top 2.54: K4.COM 51.52,-39.94 51.52,-47.93 49.16,-50.28 VALVESOLENOID_03.2
N$21
  Top 0.305: Q4.1 42.76,-43.34 R5.2
N$22
  Top 0.305: R6.1 38.43,-38.45 U$1.1
N$23
  Top 0.305: R5.1 41.73,-39.01 R6.2 41.73,-33.98 U5.3
N$24
  Top 2.54: K4.NO 35.48,-49.18 38.37,-52.07 VALVESOLENOID_03.1
N$25
  Top 0.305: R13.1 12.87,37.3 U$9.1
N$26  (1 unrouted)
N$29
  Top 0.305: U$7.1 78.64,38.41 77.04,40.01 R16.1
N$30
  Top 0.305: U2.1 79.12,-26.73 R17.2
N$31
  Top 0.305: U3.1 3.83,-26.54 R18.2
N$32
  Top 0.305: U4.1 25.02,-27.94 | 25.02,-27.94 25.4,-27.94 | 25.02,-27.94 25.53,-28.45 R19.2
N$33
  Top 0.305: U5.1 48.61,-27.77 R20.2
N$34  (1 unrouted)
N$43  (1 unrouted)
  Top 0.305: R1.2 72.63,-44.69 73.66,-45.72
PUMPRELAYSEGMENT
  Top 0.305: Q1.3 75.9,-48.57 D1.ANODE 78.74,-45.8 78.74,-44.68 K2.A2
RELAY1SEGMENT
  Top 0.305: D2.ANODE 3.63,-42.91 | 3.63,-42.91 K1.A2 | Q2.3 -0.7,-46.42 2.81,-42.91 3.63,-42.91
RELAY2SEGMENT
  Top 0.305: Q3.3 24.54,-42.24 D3.ANODE 25.56,-42.59 K3.A2
RELAY3SEGMENT
  Top 0.305: Q4.3 41.9,-47.42 D4.ANODE 47.68,-45.13 K4.A2
RTS  (2 unrouted)
VCC  (8 unrouted)
  Top 0.305: 65.88,-52.68 65.71,-52.81 65.25,-52.81 63.18,-54.86 63.18,-54.99 | U$2.3 24.23,48.69 25.15,48.69 26.09,47.75 R7.2 | K1.A1 1.39,-33.21 U3.4 | D2.CATHODE 2.22,-32.38 K1.A1 | K1.A1 5.78,-28.82 5.78,-20.87 | D3.CATHODE 24.54,-37.24 22.27,-34.97 U4.4 25.56,-31.6 K3.A1 27.09,-31.33 29.21,-29.21 29.21,-21.59 | K4.A1 46.24,-33.55 U5.4 45.39,-34.25 D4.CATHODE | K4.A1 47.91,-32.1 50.8,-29.21 50.8,-21.59 | D1.CATHODE 75.93,-33.23 U2.4 75.07,-32.1 K2.A1 82.55,-27.71 82.55,-20.32 | C4.2 59.69,-51.51 59.69,-21.59
(copper drawn outside any net)
  shapes: Top area x14410

### Text on the board
Top: GND | + | TX | RX | + | GND | GND | + | Lucio